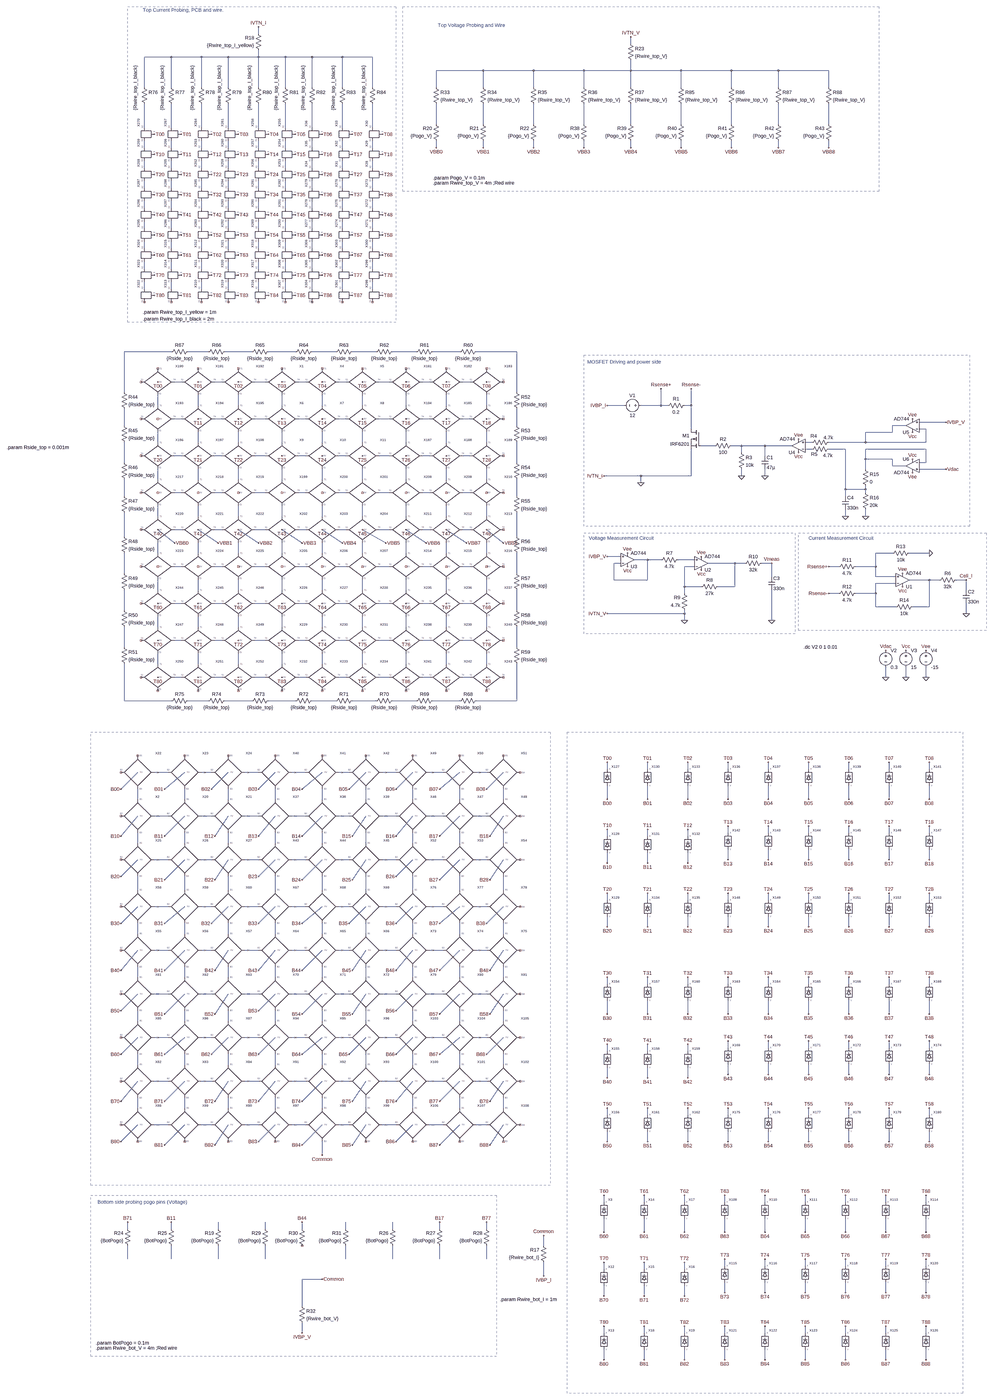
[diagram p0: schematic IVProbingV2_9x9.asc, whole sheet]
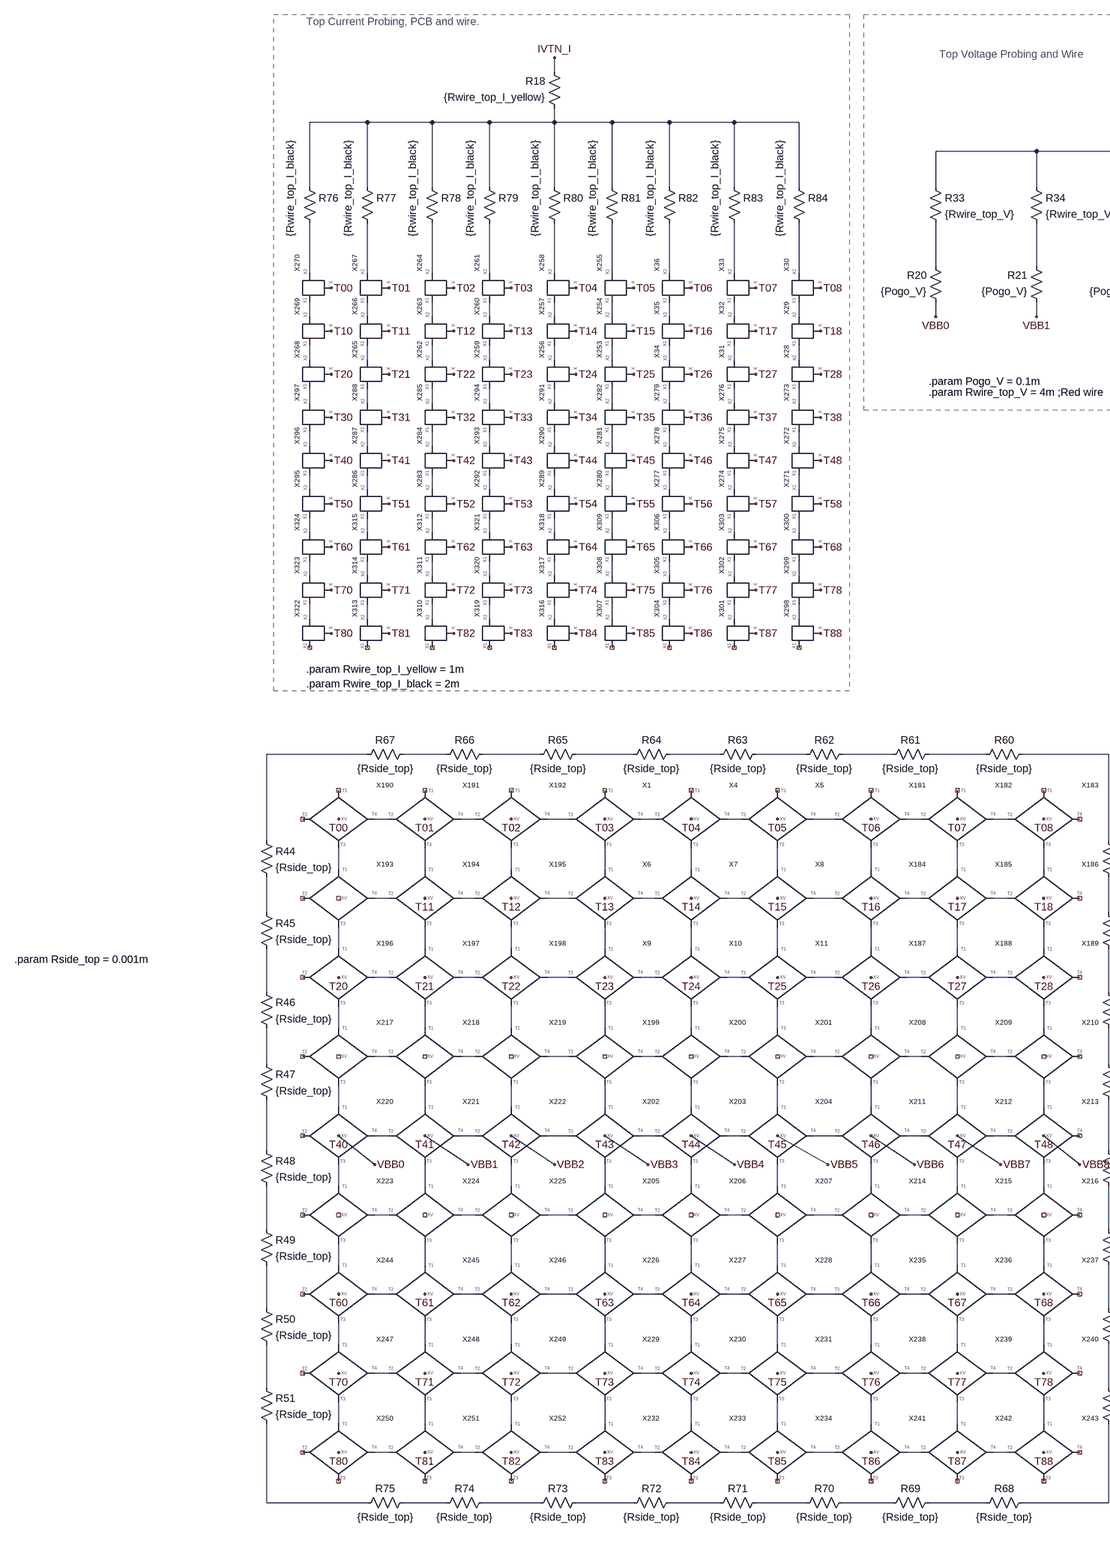
[diagram p1: schematic IVProbingV2_9x9.asc, part, row 1 of 2, column 1 of 2]
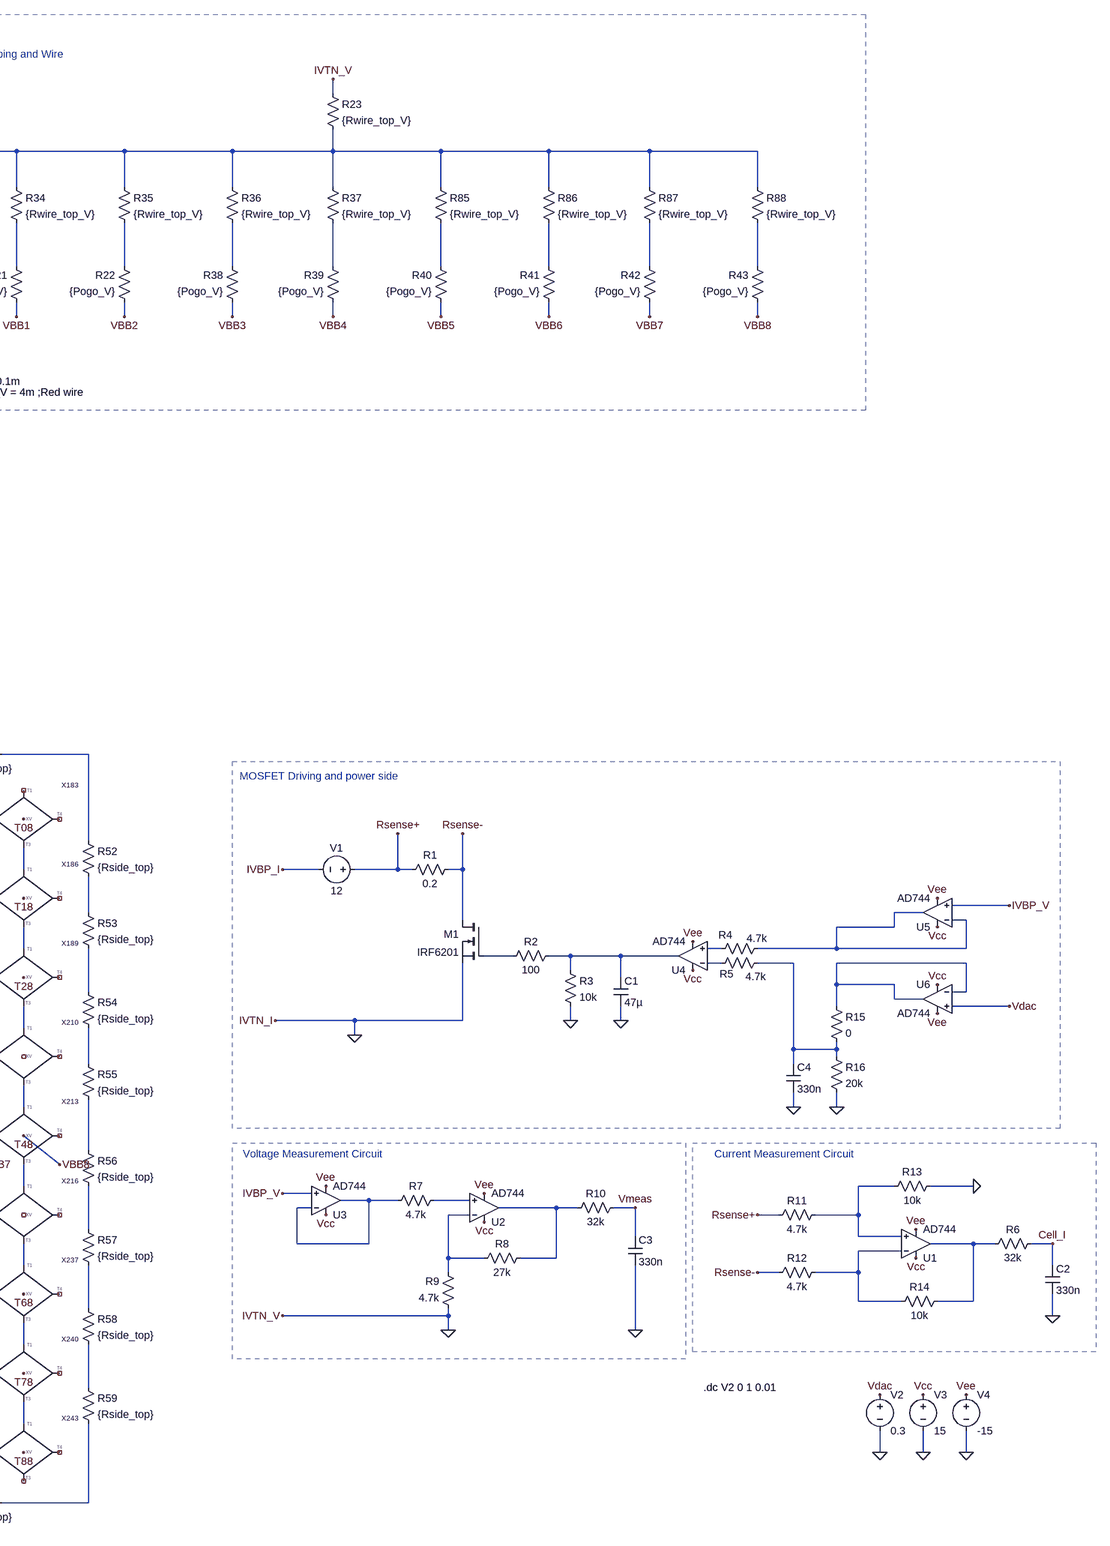
[diagram p2: schematic IVProbingV2_9x9.asc, part, row 1 of 2, column 2 of 2]
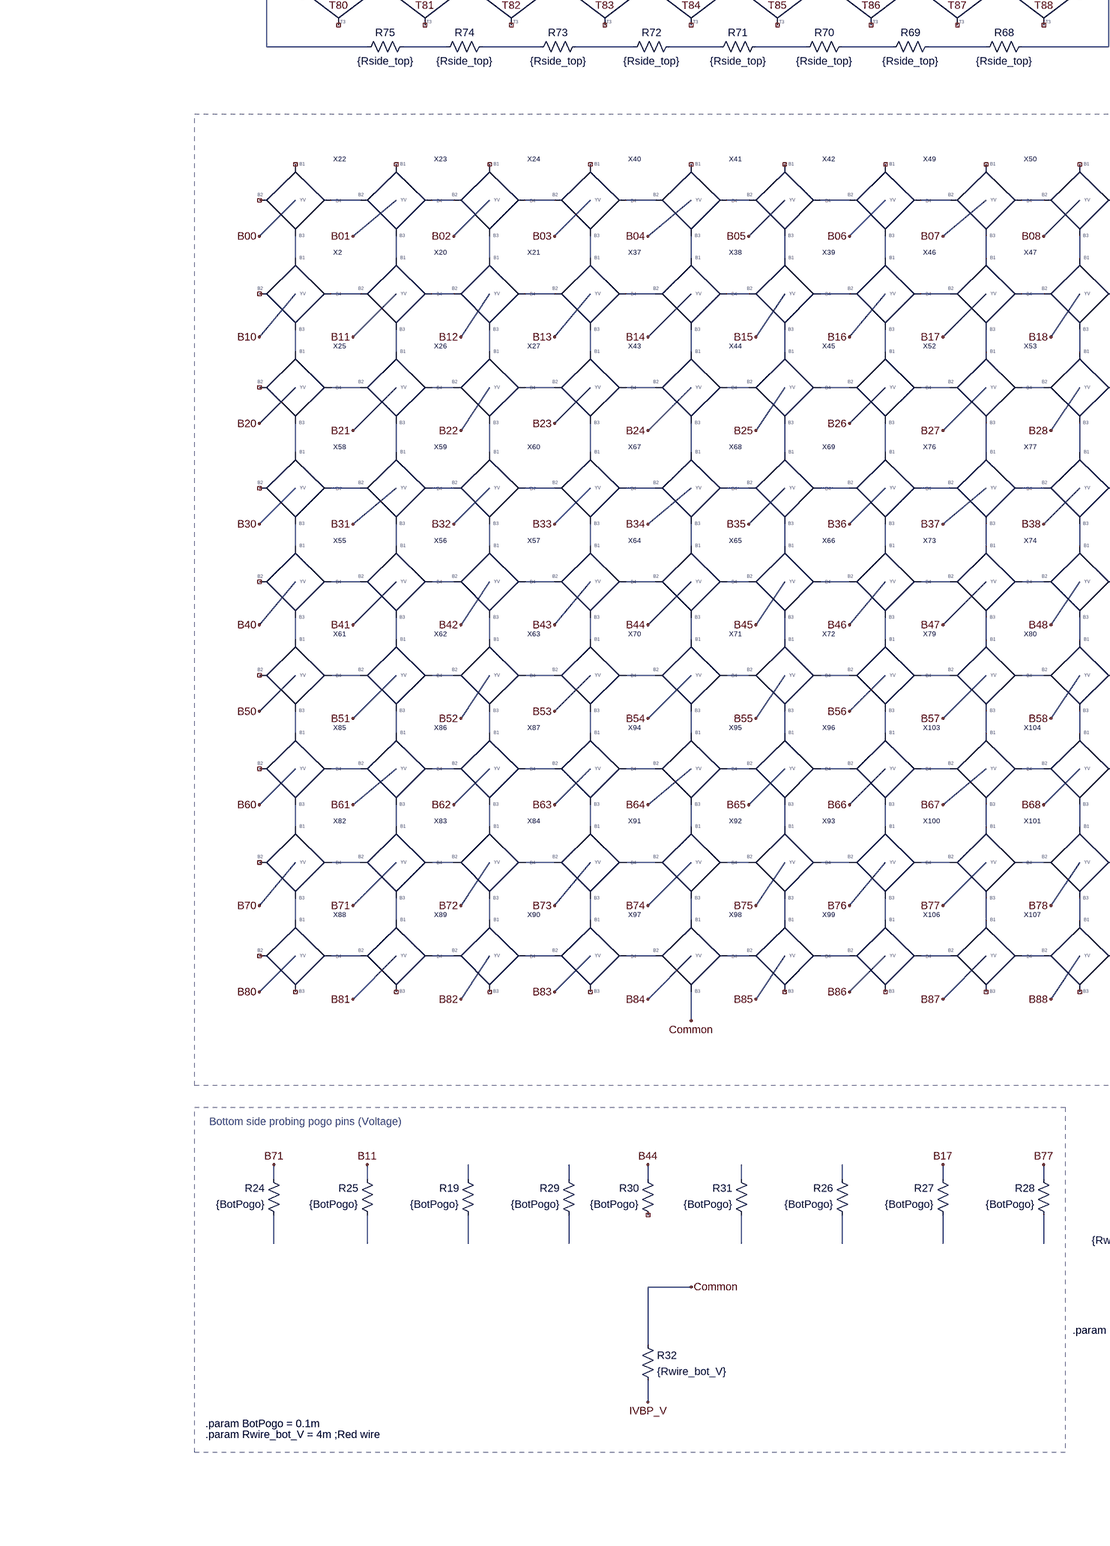
[diagram p3: schematic IVProbingV2_9x9.asc, part, row 2 of 2, column 1 of 2]
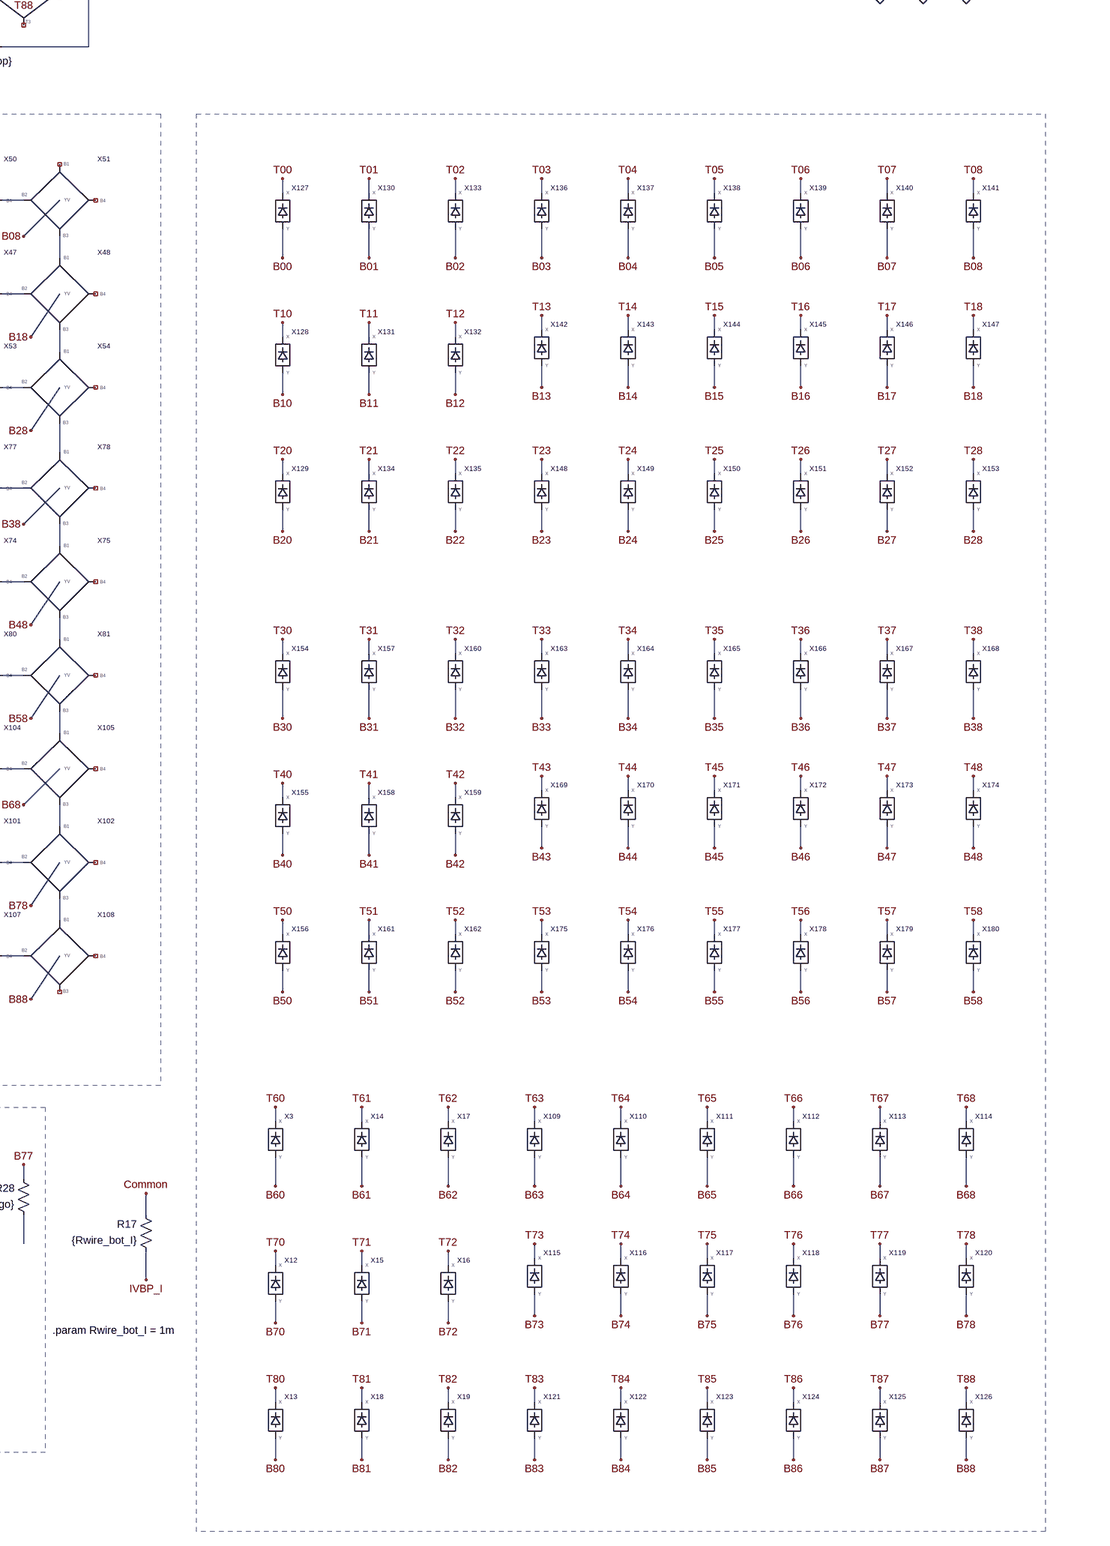
[diagram p4: schematic IVProbingV2_9x9.asc, part, row 2 of 2, column 2 of 2]
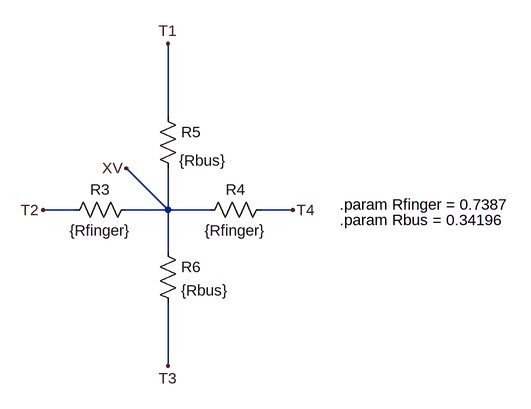
[diagram p5: sub-circuit ivtopelement.asc]
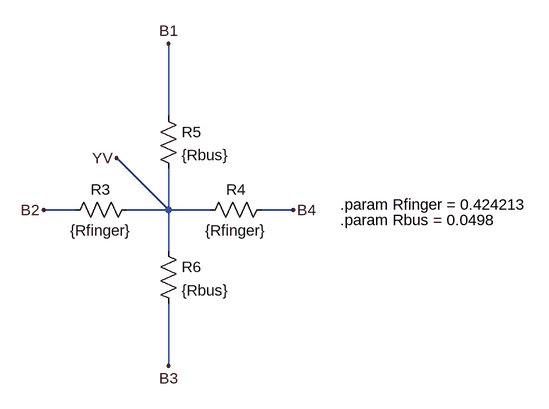
[diagram p6: sub-circuit ivbottomelement.asc]
* IVProbingV2_9x9.asc
XX1 T03 NC_01 N104 N113 N105 ivtopelement
XX2 N291 NC_02 N308 N300 B10 ivbottomelement
XX3 T60 B60 IVCellModel  ; pins X Y
R1 Rsense- Rsense+ 0.2
V1 Rsense+ IVBP_I 12
M1 Rsense- N140 0 0 IRF6201
R2 N141 N140 100
R3 N141 0 10k
C1 N141 0 47µ
R4 N129 N139 4.7k
R5 N143 N142 4.7k
V2 Vdac 0 0.3
V3 Vcc 0 15
V4 Vee 0 -15
R6 Cell_I N217 32k
C2 Cell_I 0 330n
R7 N204 N203 4.7k
R8 N205 N214 27k
R9 0 N214 4.7k
R10 Vmeas N205 32k
C3 Vmeas 0 330n
R11 N202 Rsense+ 4.7k
R12 N218 Rsense- 4.7k
R13 0 N202 10k
R14 N217 N218 10k
C4 N143 0 330n
R15 N144 N143 0
R16 N143 0 20k
XU1 N202 N218 Vcc Vee N217 AD744  ; pins In+ In- V+ V- OUT
XU2 N204 N214 Vcc Vee N205 AD744  ; pins In+ In- V+ V- OUT
XU3 IVBP_V N203 Vcc Vee N203 AD744  ; pins In+ In- V+ V- OUT
XU4 N139 N142 Vcc Vee N141 AD744  ; pins In+ In- V+ V- OUT
XU5 IVBP_V N129 Vcc Vee N129 AD744  ; pins In+ In- V+ V- OUT
XU6 Vdac N144 Vcc Vee N144 AD744  ; pins In+ In- V+ V- OUT
XX4 T04 NC_03 N105 N114 N106 ivtopelement
XX5 T05 NC_04 N106 N115 N107 ivtopelement
XX6 T13 N113 N121 N133 N122 ivtopelement
XX7 T14 N114 N122 N134 N123 ivtopelement
XX8 T15 N115 N123 N135 N124 ivtopelement
XX9 T23 N133 N147 N158 N148 ivtopelement
XX10 T24 N134 N148 N159 N149 ivtopelement
XX11 T25 N135 N149 N160 N150 ivtopelement
XX12 T70 B70 IVCellModel  ; pins X Y
XX13 T80 B80 IVCellModel  ; pins X Y
XX14 T61 B61 IVCellModel  ; pins X Y
XX15 T71 B71 IVCellModel  ; pins X Y
XX16 T72 B72 IVCellModel  ; pins X Y
XX17 T62 B62 IVCellModel  ; pins X Y
XX18 T81 B81 IVCellModel  ; pins X Y
XX19 T82 B82 IVCellModel  ; pins X Y
XX20 N292 N300 N309 N301 B11 ivbottomelement
XX21 N293 N301 N310 N302 B12 ivbottomelement
XX22 NC_05 NC_06 N291 N283 B00 ivbottomelement
XX23 NC_07 N283 N292 N284 B01 ivbottomelement
XX24 NC_08 N284 N293 N285 B02 ivbottomelement
XX25 N308 NC_09 N325 N317 B20 ivbottomelement
XX26 N309 N317 N326 N318 B21 ivbottomelement
XX27 N310 N318 N327 N319 B22 ivbottomelement
R17 IVBP_I Common {Rwire_bot_I}
XX28 T28 N047 N038 IVProbingPCB  ; pins X X1 X2
XX29 T18 N038 N029 IVProbingPCB  ; pins X X1 X2
XX30 T08 N029 N020 IVProbingPCB  ; pins X X1 X2
XX31 T27 N046 N037 IVProbingPCB  ; pins X X1 X2
XX32 T17 N037 N028 IVProbingPCB  ; pins X X1 X2
XX33 T07 N028 N019 IVProbingPCB  ; pins X X1 X2
XX34 T26 N045 N036 IVProbingPCB  ; pins X X1 X2
XX35 T16 N036 N027 IVProbingPCB  ; pins X X1 X2
XX36 T06 N027 N018 IVProbingPCB  ; pins X X1 X2
R18 N001 0 {Rwire_top_I_yellow}
R19 N433 N427 {BotPogo}
R20 T40 N003 {Pogo_V}
R21 T41 N004 {Pogo_V}
R22 T42 N005 {Pogo_V}
R23 0 N002 {Rwire_top_V}
R24 N431 B71 {BotPogo}
R25 N432 B11 {BotPogo}
R26 N436 N430 {BotPogo}
R27 N437 B17 {BotPogo}
R28 N438 B77 {BotPogo}
R29 N434 N428 {BotPogo}
R30 NC_10 B44 {BotPogo}
R31 N435 N429 {BotPogo}
R32 Common IVBP_V {Rwire_bot_V}
XX37 N294 N302 N311 N303 B13 ivbottomelement
XX38 N295 N303 N312 N304 B14 ivbottomelement
XX39 N296 N304 N313 N305 B15 ivbottomelement
XX40 NC_11 N285 N294 N286 B03 ivbottomelement
XX41 NC_12 N286 N295 N287 B04 ivbottomelement
XX42 NC_13 N287 N296 N288 B05 ivbottomelement
XX43 N311 N319 N328 N320 B23 ivbottomelement
XX44 N312 N320 N329 N321 B24 ivbottomelement
XX45 N313 N321 N330 N322 B25 ivbottomelement
XX46 N297 N305 N314 N306 B16 ivbottomelement
XX47 N298 N306 N315 N307 B17 ivbottomelement
XX48 N299 N307 N316 NC_14 B18 ivbottomelement
XX49 NC_15 N288 N297 N289 B06 ivbottomelement
XX50 NC_16 N289 N298 N290 B07 ivbottomelement
XX51 NC_17 N290 N299 NC_18 B08 ivbottomelement
XX52 N314 N322 N331 N323 B26 ivbottomelement
XX53 N315 N323 N332 N324 B27 ivbottomelement
XX54 N316 N324 N333 NC_19 B28 ivbottomelement
XX55 N342 NC_20 N359 N351 B40 ivbottomelement
XX56 N343 N351 N360 N352 B41 ivbottomelement
XX57 N344 N352 N361 N353 B42 ivbottomelement
XX58 N325 NC_21 N342 N334 B30 ivbottomelement
XX59 N326 N334 N343 N335 B31 ivbottomelement
XX60 N327 N335 N344 N336 B32 ivbottomelement
XX61 N359 NC_22 N376 N368 B50 ivbottomelement
XX62 N360 N368 N377 N369 B51 ivbottomelement
XX63 N361 N369 N378 N370 B52 ivbottomelement
XX64 N345 N353 N362 N354 B43 ivbottomelement
XX65 N346 N354 N363 N355 B44 ivbottomelement
XX66 N347 N355 N364 N356 B45 ivbottomelement
XX67 N328 N336 N345 N337 B33 ivbottomelement
XX68 N329 N337 N346 N338 B34 ivbottomelement
XX69 N330 N338 N347 N339 B35 ivbottomelement
XX70 N362 N370 N379 N371 B53 ivbottomelement
XX71 N363 N371 N380 N372 B54 ivbottomelement
XX72 N364 N372 N381 N373 B55 ivbottomelement
XX73 N348 N356 N365 N357 B46 ivbottomelement
XX74 N349 N357 N366 N358 B47 ivbottomelement
XX75 N350 N358 N367 NC_23 B48 ivbottomelement
XX76 N331 N339 N348 N340 B36 ivbottomelement
XX77 N332 N340 N349 N341 B37 ivbottomelement
XX78 N333 N341 N350 NC_24 B38 ivbottomelement
XX79 N365 N373 N382 N374 B56 ivbottomelement
XX80 N366 N374 N383 N375 B57 ivbottomelement
XX81 N367 N375 N384 NC_25 B58 ivbottomelement
XX82 N393 NC_26 N410 N402 B70 ivbottomelement
XX83 N394 N402 N411 N403 B71 ivbottomelement
XX84 N395 N403 N412 N404 B72 ivbottomelement
XX85 N376 NC_27 N393 N385 B60 ivbottomelement
XX86 N377 N385 N394 N386 B61 ivbottomelement
XX87 N378 N386 N395 N387 B62 ivbottomelement
XX88 N410 NC_28 NC_29 N419 B80 ivbottomelement
XX89 N411 N419 NC_30 N420 B81 ivbottomelement
XX90 N412 N420 NC_31 N421 B82 ivbottomelement
XX91 N396 N404 N413 N405 B73 ivbottomelement
XX92 N397 N405 N414 N406 B74 ivbottomelement
XX93 N398 N406 N415 N407 B75 ivbottomelement
XX94 N379 N387 N396 N388 B63 ivbottomelement
XX95 N380 N388 N397 N389 B64 ivbottomelement
XX96 N381 N389 N398 N390 B65 ivbottomelement
XX97 N413 N421 NC_32 N422 B83 ivbottomelement
XX98 N414 N422 Common N423 B84 ivbottomelement
XX99 N415 N423 NC_33 N424 B85 ivbottomelement
XX100 N399 N407 N416 N408 B76 ivbottomelement
XX101 N400 N408 N417 N409 B77 ivbottomelement
XX102 N401 N409 N418 NC_34 B78 ivbottomelement
XX103 N382 N390 N399 N391 B66 ivbottomelement
XX104 N383 N391 N400 N392 B67 ivbottomelement
XX105 N384 N392 N401 NC_35 B68 ivbottomelement
XX106 N416 N424 NC_36 N425 B86 ivbottomelement
XX107 N417 N425 NC_37 N426 B87 ivbottomelement
XX108 N418 N426 NC_38 NC_39 B88 ivbottomelement
XX109 T63 B63 IVCellModel  ; pins X Y
XX110 T64 B64 IVCellModel  ; pins X Y
XX111 T65 B65 IVCellModel  ; pins X Y
XX112 T66 B66 IVCellModel  ; pins X Y
XX113 T67 B67 IVCellModel  ; pins X Y
XX114 T68 B68 IVCellModel  ; pins X Y
XX115 T73 B73 IVCellModel  ; pins X Y
XX116 T74 B74 IVCellModel  ; pins X Y
XX117 T75 B75 IVCellModel  ; pins X Y
XX118 T76 B76 IVCellModel  ; pins X Y
XX119 T77 B77 IVCellModel  ; pins X Y
XX120 T78 B78 IVCellModel  ; pins X Y
XX121 T83 B83 IVCellModel  ; pins X Y
XX122 T84 B84 IVCellModel  ; pins X Y
XX123 T85 B85 IVCellModel  ; pins X Y
XX124 T86 B86 IVCellModel  ; pins X Y
XX125 T87 B87 IVCellModel  ; pins X Y
XX126 T88 B88 IVCellModel  ; pins X Y
XX127 T00 B00 IVCellModel  ; pins X Y
XX128 T10 B10 IVCellModel  ; pins X Y
XX129 T20 B20 IVCellModel  ; pins X Y
XX130 T01 B01 IVCellModel  ; pins X Y
XX131 T11 B11 IVCellModel  ; pins X Y
XX132 T12 B12 IVCellModel  ; pins X Y
XX133 T02 B02 IVCellModel  ; pins X Y
XX134 T21 B21 IVCellModel  ; pins X Y
XX135 T22 B22 IVCellModel  ; pins X Y
XX136 T03 B03 IVCellModel  ; pins X Y
XX137 T04 B04 IVCellModel  ; pins X Y
XX138 T05 B05 IVCellModel  ; pins X Y
XX139 T06 B06 IVCellModel  ; pins X Y
XX140 T07 B07 IVCellModel  ; pins X Y
XX141 T08 B08 IVCellModel  ; pins X Y
XX142 T13 B13 IVCellModel  ; pins X Y
XX143 T14 B14 IVCellModel  ; pins X Y
XX144 T15 B15 IVCellModel  ; pins X Y
XX145 T16 B16 IVCellModel  ; pins X Y
XX146 T17 B17 IVCellModel  ; pins X Y
XX147 T18 B18 IVCellModel  ; pins X Y
XX148 T23 B23 IVCellModel  ; pins X Y
XX149 T24 B24 IVCellModel  ; pins X Y
XX150 T25 B25 IVCellModel  ; pins X Y
XX151 T26 B26 IVCellModel  ; pins X Y
XX152 T27 B27 IVCellModel  ; pins X Y
XX153 T28 B28 IVCellModel  ; pins X Y
XX154 T30 B30 IVCellModel  ; pins X Y
XX155 T40 B40 IVCellModel  ; pins X Y
XX156 T50 B50 IVCellModel  ; pins X Y
XX157 T31 B31 IVCellModel  ; pins X Y
XX158 T41 B41 IVCellModel  ; pins X Y
XX159 T42 B42 IVCellModel  ; pins X Y
XX160 T32 B32 IVCellModel  ; pins X Y
XX161 T51 B51 IVCellModel  ; pins X Y
XX162 T52 B52 IVCellModel  ; pins X Y
XX163 T33 B33 IVCellModel  ; pins X Y
XX164 T34 B34 IVCellModel  ; pins X Y
XX165 T35 B35 IVCellModel  ; pins X Y
XX166 T36 B36 IVCellModel  ; pins X Y
XX167 T37 B37 IVCellModel  ; pins X Y
XX168 T38 B38 IVCellModel  ; pins X Y
XX169 VBB3 B43 IVCellModel  ; pins X Y
XX170 VBB4 B44 IVCellModel  ; pins X Y
XX171 VBB5 B45 IVCellModel  ; pins X Y
XX172 VBB6 B46 IVCellModel  ; pins X Y
XX173 VBB7 B47 IVCellModel  ; pins X Y
XX174 VBB8 B48 IVCellModel  ; pins X Y
XX175 T53 B53 IVCellModel  ; pins X Y
XX176 T54 B54 IVCellModel  ; pins X Y
XX177 T55 B55 IVCellModel  ; pins X Y
XX178 T56 B56 IVCellModel  ; pins X Y
XX179 T57 B57 IVCellModel  ; pins X Y
XX180 T58 B58 IVCellModel  ; pins X Y
XX181 T06 NC_40 N107 N116 N108 ivtopelement
XX182 T07 NC_41 N108 N117 N109 ivtopelement
XX183 T08 NC_42 N109 N118 NC_43 ivtopelement
XX184 T16 N116 N124 N136 N125 ivtopelement
XX185 T17 N117 N125 N137 N126 ivtopelement
XX186 T18 N118 N126 N138 NC_44 ivtopelement
XX187 T26 N136 N150 N161 N151 ivtopelement
XX188 T27 N137 N151 N162 N152 ivtopelement
XX189 T28 N138 N152 N163 NC_45 ivtopelement
XX190 T00 NC_46 NC_47 N110 N102 ivtopelement
XX191 T01 NC_48 N102 N111 N103 ivtopelement
XX192 T02 NC_49 N103 N112 N104 ivtopelement
XX193 NC_50 N110 NC_51 N130 N119 ivtopelement
XX194 T11 N111 N119 N131 N120 ivtopelement
XX195 T12 N112 N120 N132 N121 ivtopelement
XX196 T20 N130 NC_52 N155 N145 ivtopelement
XX197 T21 N131 N145 N156 N146 ivtopelement
XX198 T22 N132 N146 N157 N147 ivtopelement
XX199 NC_53 N158 N166 N177 N167 ivtopelement
XX200 NC_54 N159 N167 N178 N168 ivtopelement
XX201 NC_55 N160 N168 N179 N169 ivtopelement
XX202 VBB3 N177 N185 N196 N186 ivtopelement
XX203 VBB4 N178 N186 N197 N187 ivtopelement
XX204 VBB5 N179 N187 N198 N188 ivtopelement
XX205 NC_56 N196 N208 N222 N209 ivtopelement
XX206 NC_57 N197 N209 N223 N210 ivtopelement
XX207 NC_58 N198 N210 N224 N211 ivtopelement
XX208 NC_59 N161 N169 N180 N170 ivtopelement
XX209 NC_60 N162 N170 N181 N171 ivtopelement
XX210 NC_61 N163 N171 N182 NC_62 ivtopelement
XX211 VBB6 N180 N188 N199 N189 ivtopelement
XX212 VBB7 N181 N189 N200 N190 ivtopelement
XX213 VBB8 N182 N190 N201 NC_63 ivtopelement
XX214 NC_64 N199 N211 N225 N212 ivtopelement
XX215 NC_65 N200 N212 N226 N213 ivtopelement
XX216 NC_66 N201 N213 N227 NC_67 ivtopelement
XX217 NC_68 N155 NC_69 N174 N164 ivtopelement
XX218 NC_70 N156 N164 N175 N165 ivtopelement
XX219 NC_71 N157 N165 N176 N166 ivtopelement
XX220 T40 N174 NC_72 N193 N183 ivtopelement
XX221 T41 N175 N183 N194 N184 ivtopelement
XX222 T42 N176 N184 N195 N185 ivtopelement
XX223 NC_73 N193 NC_74 N219 N206 ivtopelement
XX224 NC_75 N194 N206 N220 N207 ivtopelement
XX225 NC_76 N195 N207 N221 N208 ivtopelement
XX226 T63 N222 N230 N241 N231 ivtopelement
XX227 T64 N223 N231 N242 N232 ivtopelement
XX228 T65 N224 N232 N243 N233 ivtopelement
XX229 T73 N241 N249 N260 N250 ivtopelement
XX230 T74 N242 N250 N261 N251 ivtopelement
XX231 T75 N243 N251 N262 N252 ivtopelement
XX232 T83 N260 N268 NC_77 N269 ivtopelement
XX233 T84 N261 N269 NC_78 N270 ivtopelement
XX234 T85 N262 N270 NC_79 N271 ivtopelement
XX235 T66 N225 N233 N244 N234 ivtopelement
XX236 T67 N226 N234 N245 N235 ivtopelement
XX237 T68 N227 N235 N246 NC_80 ivtopelement
XX238 T76 N244 N252 N263 N253 ivtopelement
XX239 T77 N245 N253 N264 N254 ivtopelement
XX240 T78 N246 N254 N265 NC_81 ivtopelement
XX241 T86 N263 N271 NC_82 N272 ivtopelement
XX242 T87 N264 N272 NC_83 N273 ivtopelement
XX243 T88 N265 N273 NC_84 NC_85 ivtopelement
XX244 T60 N219 NC_86 N238 N228 ivtopelement
XX245 T61 N220 N228 N239 N229 ivtopelement
XX246 T62 N221 N229 N240 N230 ivtopelement
XX247 T70 N238 NC_87 N257 N247 ivtopelement
XX248 T71 N239 N247 N258 N248 ivtopelement
XX249 T72 N240 N248 N259 N249 ivtopelement
XX250 T80 N257 NC_88 NC_89 N266 ivtopelement
XX251 T81 N258 N266 NC_90 N267 ivtopelement
XX252 T82 N259 N267 NC_91 N268 ivtopelement
XX253 T25 N044 N035 IVProbingPCB  ; pins X X1 X2
XX254 T15 N035 N026 IVProbingPCB  ; pins X X1 X2
XX255 T05 N026 N017 IVProbingPCB  ; pins X X1 X2
XX256 T24 N043 N034 IVProbingPCB  ; pins X X1 X2
XX257 T14 N034 N025 IVProbingPCB  ; pins X X1 X2
XX258 T04 N025 N016 IVProbingPCB  ; pins X X1 X2
XX259 T23 N042 N033 IVProbingPCB  ; pins X X1 X2
XX260 T13 N033 N024 IVProbingPCB  ; pins X X1 X2
XX261 T03 N024 N015 IVProbingPCB  ; pins X X1 X2
XX262 T22 N041 N032 IVProbingPCB  ; pins X X1 X2
XX263 T12 N032 N023 IVProbingPCB  ; pins X X1 X2
XX264 T02 N023 N014 IVProbingPCB  ; pins X X1 X2
XX265 T21 N040 N031 IVProbingPCB  ; pins X X1 X2
XX266 T11 N031 N022 IVProbingPCB  ; pins X X1 X2
XX267 T01 N022 N013 IVProbingPCB  ; pins X X1 X2
XX268 T20 N039 N030 IVProbingPCB  ; pins X X1 X2
XX269 T10 N030 N021 IVProbingPCB  ; pins X X1 X2
XX270 T00 N021 N012 IVProbingPCB  ; pins X X1 X2
XX271 T58 N074 N065 IVProbingPCB  ; pins X X1 X2
XX272 VBB8 N065 N056 IVProbingPCB  ; pins X X1 X2
XX273 T38 N056 N047 IVProbingPCB  ; pins X X1 X2
XX274 T57 N073 N064 IVProbingPCB  ; pins X X1 X2
XX275 VBB7 N064 N055 IVProbingPCB  ; pins X X1 X2
XX276 T37 N055 N046 IVProbingPCB  ; pins X X1 X2
XX277 T56 N072 N063 IVProbingPCB  ; pins X X1 X2
XX278 VBB6 N063 N054 IVProbingPCB  ; pins X X1 X2
XX279 T36 N054 N045 IVProbingPCB  ; pins X X1 X2
XX280 T55 N071 N062 IVProbingPCB  ; pins X X1 X2
XX281 VBB5 N062 N053 IVProbingPCB  ; pins X X1 X2
XX282 T35 N053 N044 IVProbingPCB  ; pins X X1 X2
XX283 T52 N068 N059 IVProbingPCB  ; pins X X1 X2
XX284 T42 N059 N050 IVProbingPCB  ; pins X X1 X2
XX285 T32 N050 N041 IVProbingPCB  ; pins X X1 X2
XX286 T51 N067 N058 IVProbingPCB  ; pins X X1 X2
XX287 T41 N058 N049 IVProbingPCB  ; pins X X1 X2
XX288 T31 N049 N040 IVProbingPCB  ; pins X X1 X2
XX289 T54 N070 N061 IVProbingPCB  ; pins X X1 X2
XX290 VBB4 N061 N052 IVProbingPCB  ; pins X X1 X2
XX291 T34 N052 N043 IVProbingPCB  ; pins X X1 X2
XX292 T53 N069 N060 IVProbingPCB  ; pins X X1 X2
XX293 VBB3 N060 N051 IVProbingPCB  ; pins X X1 X2
XX294 T33 N051 N042 IVProbingPCB  ; pins X X1 X2
XX295 T50 N066 N057 IVProbingPCB  ; pins X X1 X2
XX296 T40 N057 N048 IVProbingPCB  ; pins X X1 X2
XX297 T30 N048 N039 IVProbingPCB  ; pins X X1 X2
XX298 T88 NC_92 N092 IVProbingPCB  ; pins X X1 X2
XX299 T78 N092 N083 IVProbingPCB  ; pins X X1 X2
XX300 T68 N083 N074 IVProbingPCB  ; pins X X1 X2
XX301 T87 NC_93 N091 IVProbingPCB  ; pins X X1 X2
XX302 T77 N091 N082 IVProbingPCB  ; pins X X1 X2
XX303 T67 N082 N073 IVProbingPCB  ; pins X X1 X2
XX304 T86 NC_94 N090 IVProbingPCB  ; pins X X1 X2
XX305 T76 N090 N081 IVProbingPCB  ; pins X X1 X2
XX306 T66 N081 N072 IVProbingPCB  ; pins X X1 X2
XX307 T85 NC_95 N089 IVProbingPCB  ; pins X X1 X2
XX308 T75 N089 N080 IVProbingPCB  ; pins X X1 X2
XX309 T65 N080 N071 IVProbingPCB  ; pins X X1 X2
XX310 T82 NC_96 N086 IVProbingPCB  ; pins X X1 X2
XX311 T72 N086 N077 IVProbingPCB  ; pins X X1 X2
XX312 T62 N077 N068 IVProbingPCB  ; pins X X1 X2
XX313 T81 NC_97 N085 IVProbingPCB  ; pins X X1 X2
XX314 T71 N085 N076 IVProbingPCB  ; pins X X1 X2
XX315 T61 N076 N067 IVProbingPCB  ; pins X X1 X2
XX316 T84 NC_98 N088 IVProbingPCB  ; pins X X1 X2
XX317 T74 N088 N079 IVProbingPCB  ; pins X X1 X2
XX318 T64 N079 N070 IVProbingPCB  ; pins X X1 X2
XX319 T83 NC_99 N087 IVProbingPCB  ; pins X X1 X2
XX320 T73 N087 N078 IVProbingPCB  ; pins X X1 X2
XX321 T63 N078 N069 IVProbingPCB  ; pins X X1 X2
XX322 T80 NC_100 N084 IVProbingPCB  ; pins X X1 X2
XX323 T70 N084 N075 IVProbingPCB  ; pins X X1 X2
XX324 T60 N075 N066 IVProbingPCB  ; pins X X1 X2
R38 VBB3 N006 {Pogo_V}
R39 VBB4 N007 {Pogo_V}
R40 VBB5 N008 {Pogo_V}
R41 VBB6 N009 {Pogo_V}
R42 VBB7 N010 {Pogo_V}
R43 VBB8 N011 {Pogo_V}
R44 N093 N127 {Rside_top}
R45 N127 N153 {Rside_top}
R46 N153 N172 {Rside_top}
R47 N172 N191 {Rside_top}
R48 N191 N215 {Rside_top}
R49 N215 N236 {Rside_top}
R50 N236 N255 {Rside_top}
R51 N255 N274 {Rside_top}
R52 N101 N128 {Rside_top}
R53 N128 N154 {Rside_top}
R54 N154 N173 {Rside_top}
R55 N173 N192 {Rside_top}
R56 N192 N216 {Rside_top}
R57 N216 N237 {Rside_top}
R58 N237 N256 {Rside_top}
R59 N256 N282 {Rside_top}
R60 N101 N100 {Rside_top}
R61 N100 N099 {Rside_top}
R62 N099 N098 {Rside_top}
R63 N098 N097 {Rside_top}
R64 N097 N096 {Rside_top}
R65 N096 N095 {Rside_top}
R66 N095 N094 {Rside_top}
R67 N094 N093 {Rside_top}
R68 N282 N281 {Rside_top}
R69 N281 N280 {Rside_top}
R70 N280 N279 {Rside_top}
R71 N279 N278 {Rside_top}
R72 N278 N277 {Rside_top}
R73 N277 N276 {Rside_top}
R74 N276 N275 {Rside_top}
R75 N275 N274 {Rside_top}
R76 N001 N012 {Rwire_top_I_black}
R77 N001 N013 {Rwire_top_I_black}
R78 N001 N014 {Rwire_top_I_black}
R79 N001 N015 {Rwire_top_I_black}
R80 N001 N016 {Rwire_top_I_black}
R81 N001 N017 {Rwire_top_I_black}
R82 N001 N018 {Rwire_top_I_black}
R83 N001 N019 {Rwire_top_I_black}
R84 N001 N020 {Rwire_top_I_black}
R33 N002 N003 {Rwire_top_V}
R34 N002 N004 {Rwire_top_V}
R35 N002 N005 {Rwire_top_V}
R36 N002 N006 {Rwire_top_V}
R37 N002 N007 {Rwire_top_V}
R85 N002 N008 {Rwire_top_V}
R86 N002 N009 {Rwire_top_V}
R87 N002 N010 {Rwire_top_V}
R88 N002 N011 {Rwire_top_V}

* block symbol definitions
.subckt ivtopelement XV T1 T2 T3 T4
R3 XV T2 {Rfinger}
R4 T4 XV {Rfinger}
R5 T1 XV {Rbus}
R6 XV T3 {Rbus}
.param Rfinger = 0.7387
.param Rbus = 0.34196
.ends ivtopelement

.subckt ivbottomelement B1 B2 B3 B4 YV
R3 YV B2 {Rfinger}
R4 B4 YV {Rfinger}
R5 B1 YV {Rbus}
R6 YV B3 {Rbus}
.param Rfinger = 0.424213
.param Rbus = 0.0498
.ends ivbottomelement

.model NMOS NMOS
.model PMOS PMOS
.lib standard.mos
.dc V2 0 1 0.01
* Voltage Measurement Circuit
* Current Measurement Circuit
* MOSFET Driving and power side
.param Rwire_bot_I = 1m
.param Rwire_top_I_yellow = 1m
* Top Current Probing, PCB and wire.
.param Rwire_top_V = 4m ;Red wire
.param BotPogo = 0.1m
.param Rwire_bot_V = 4m ;Red wire
.param Pogo_V = 0.1m
* Top Voltage Probing and Wire
* Bottom side probing pogo pins (Voltage)
.param Rside_top = 0.001m
.param Rwire_top_I_black = 2m
.backanno
.end